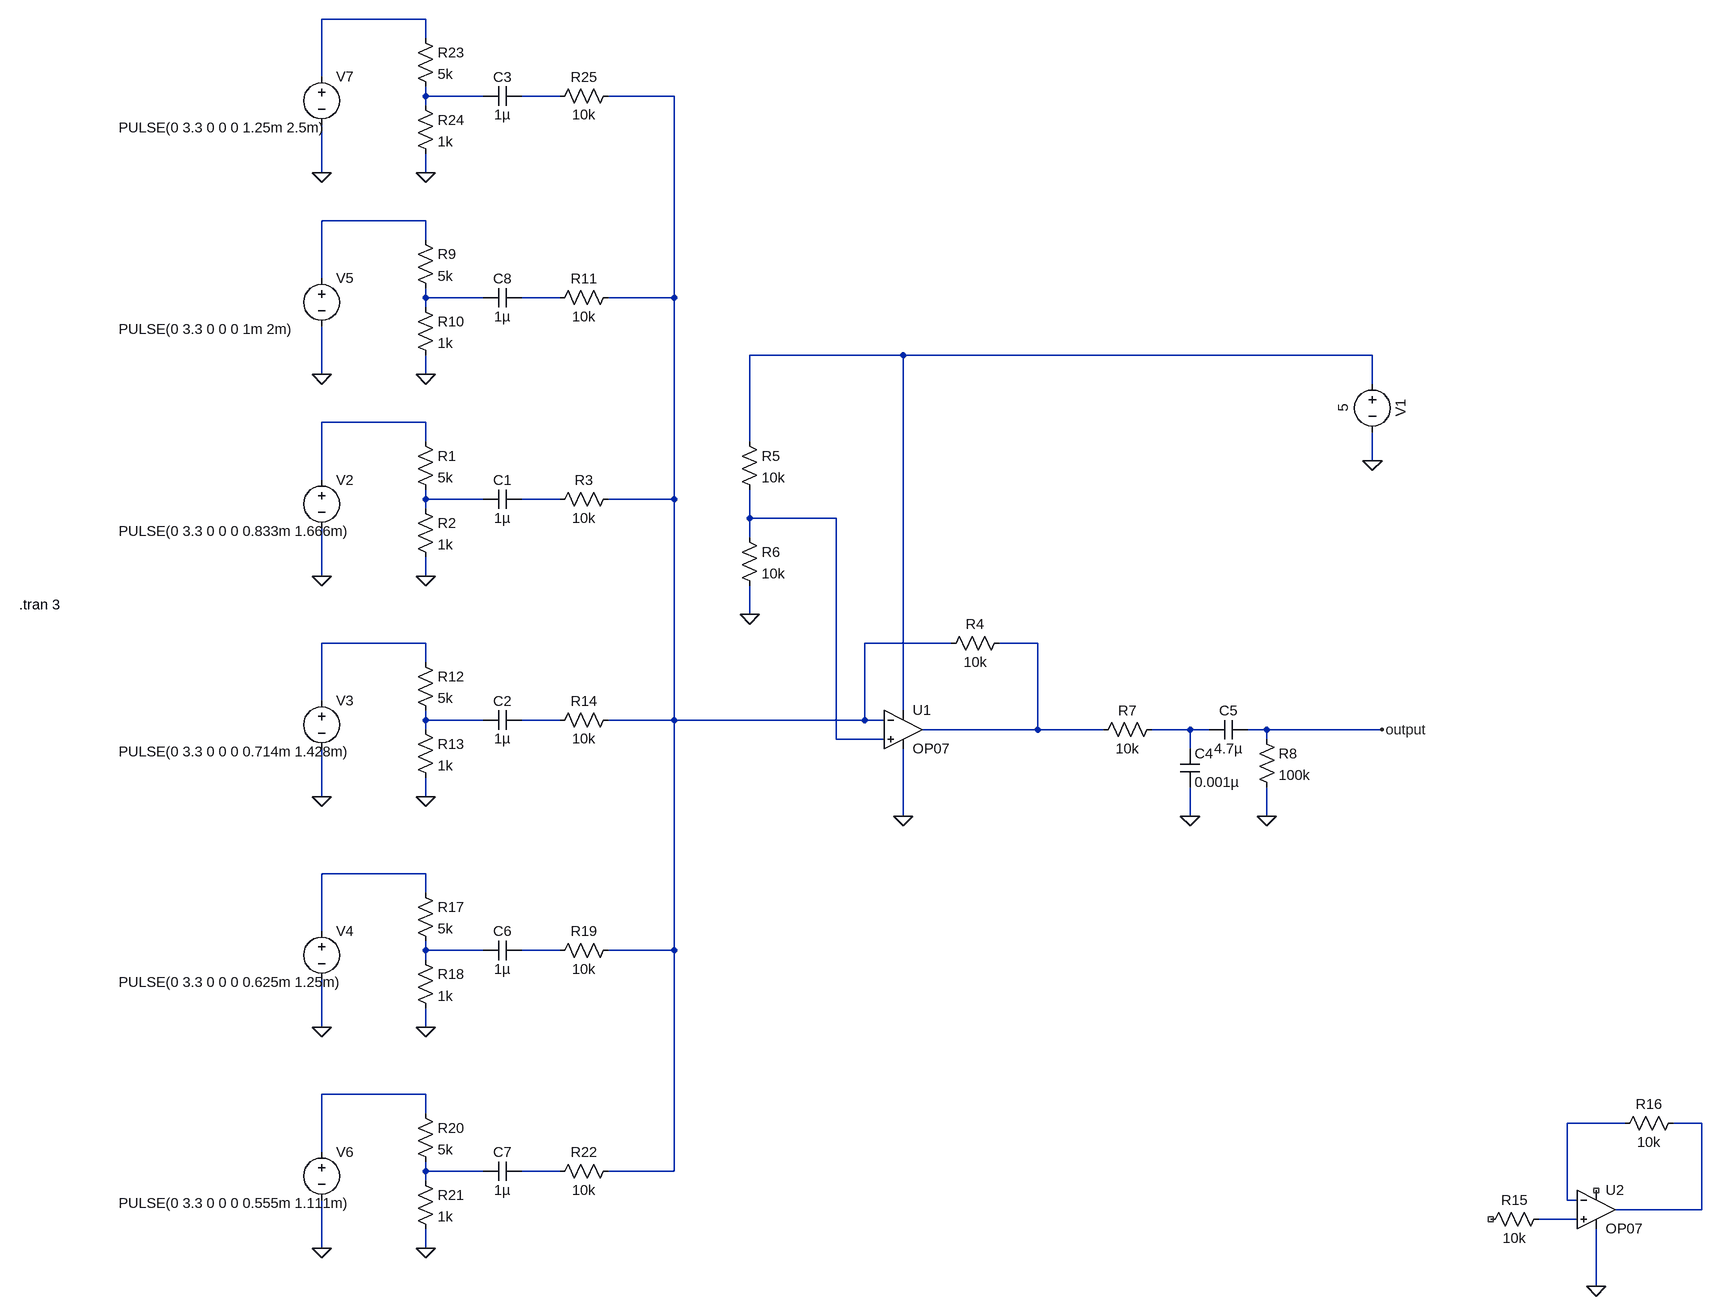
[diagram p0: schematic mixer_circuit_simulation.asc]
mixer_circuit_simulation.asc, the LTspice schematic file:
Version 4
SHEET 1 3092 1204
WIRE -592 -1200 -832 -1200
WIRE -592 -1168 -592 -1200
WIRE -832 -1104 -832 -1200
WIRE -592 -1072 -592 -1088
WIRE -496 -1072 -592 -1072
WIRE -368 -1072 -432 -1072
WIRE -128 -1072 -288 -1072
WIRE -592 -1056 -592 -1072
WIRE -832 -944 -832 -1024
WIRE -592 -944 -592 -976
WIRE -592 -864 -832 -864
WIRE -592 -832 -592 -864
WIRE -832 -768 -832 -864
WIRE -592 -736 -592 -752
WIRE -496 -736 -592 -736
WIRE -368 -736 -432 -736
WIRE -128 -736 -128 -1072
WIRE -128 -736 -288 -736
WIRE -592 -720 -592 -736
WIRE 384 -640 128 -640
WIRE 1216 -640 384 -640
WIRE -832 -608 -832 -688
WIRE -592 -608 -592 -640
WIRE 1216 -592 1216 -640
WIRE -592 -528 -832 -528
WIRE -592 -496 -592 -528
WIRE 128 -496 128 -640
WIRE 1216 -464 1216 -512
WIRE -832 -432 -832 -528
WIRE -592 -400 -592 -416
WIRE -496 -400 -592 -400
WIRE -368 -400 -432 -400
WIRE -128 -400 -128 -736
WIRE -128 -400 -288 -400
WIRE -592 -384 -592 -400
WIRE 128 -368 128 -416
WIRE 272 -368 128 -368
WIRE 128 -336 128 -368
WIRE -832 -272 -832 -352
WIRE -592 -272 -592 -304
WIRE 128 -208 128 -256
WIRE -592 -160 -832 -160
WIRE 464 -160 320 -160
WIRE 608 -160 544 -160
WIRE -592 -128 -592 -160
WIRE -832 -64 -832 -160
WIRE 384 -48 384 -640
WIRE -592 -32 -592 -48
WIRE -496 -32 -592 -32
WIRE -368 -32 -432 -32
WIRE -128 -32 -128 -400
WIRE -128 -32 -288 -32
WIRE 320 -32 320 -160
WIRE 320 -32 -128 -32
WIRE 352 -32 320 -32
WIRE -592 -16 -592 -32
WIRE 608 -16 608 -160
WIRE 608 -16 416 -16
WIRE 768 -16 608 -16
WIRE 912 -16 848 -16
WIRE 944 -16 912 -16
WIRE 1040 -16 1008 -16
WIRE 1232 -16 1040 -16
WIRE 272 0 272 -368
WIRE 352 0 272 0
WIRE 1040 0 1040 -16
WIRE 912 16 912 -16
WIRE -832 96 -832 16
WIRE -592 96 -592 64
WIRE 384 128 384 16
WIRE 912 128 912 80
WIRE 1040 128 1040 80
WIRE -592 224 -832 224
WIRE -592 256 -592 224
WIRE -832 320 -832 224
WIRE -592 352 -592 336
WIRE -496 352 -592 352
WIRE -368 352 -432 352
WIRE -128 352 -128 -32
WIRE -128 352 -288 352
WIRE -592 368 -592 352
WIRE -832 480 -832 400
WIRE -592 480 -592 448
WIRE -592 592 -832 592
WIRE -592 624 -592 592
WIRE 2272 640 2176 640
WIRE 2400 640 2352 640
WIRE -832 688 -832 592
WIRE -592 720 -592 704
WIRE -496 720 -592 720
WIRE -368 720 -432 720
WIRE -128 720 -128 352
WIRE -128 720 -288 720
WIRE -592 736 -592 720
WIRE 2176 768 2176 640
WIRE 2192 768 2176 768
WIRE 2400 784 2400 640
WIRE 2400 784 2256 784
WIRE 2192 800 2128 800
WIRE -832 848 -832 768
WIRE -592 848 -592 816
WIRE 2224 912 2224 816
FLAG 128 -208 0
FLAG 384 128 0
FLAG 1232 -16 output
FLAG 912 128 0
FLAG -832 -608 0
FLAG -592 -608 0
FLAG -832 -272 0
FLAG -592 -272 0
FLAG -832 96 0
FLAG -592 96 0
FLAG 2224 912 0
FLAG -832 480 0
FLAG -592 480 0
FLAG -832 848 0
FLAG -592 848 0
FLAG 1040 128 0
FLAG 1216 -464 0
FLAG -832 -944 0
FLAG -592 -944 0
SYMBOL res 560 -176 R90
WINDOW 0 0 56 VBottom 2
WINDOW 3 32 56 VTop 2
SYMATTR InstName R4
SYMATTR Value 10k
SYMBOL OpAmps\\OP07 384 -80 R0
SYMATTR InstName U1
SYMBOL voltage 1216 -608 R0
WINDOW 0 32 56 VTop 2
WINDOW 3 -32 56 VBottom 2
WINDOW 123 0 0 Left 0
WINDOW 39 0 0 Left 0
SYMATTR InstName V1
SYMATTR Value 5
SYMBOL res 112 -512 R0
SYMATTR InstName R5
SYMATTR Value 10k
SYMBOL res 112 -352 R0
SYMATTR InstName R6
SYMATTR Value 10k
SYMBOL res 864 -32 R90
WINDOW 0 0 56 VBottom 2
WINDOW 3 32 56 VTop 2
SYMATTR InstName R7
SYMATTR Value 10k
SYMBOL cap 896 16 R0
SYMATTR InstName C4
SYMATTR Value 0.001µ
SYMBOL res 1024 -16 R0
SYMATTR InstName R8
SYMATTR Value 100k
SYMBOL cap 1008 -32 R90
WINDOW 0 0 32 VBottom 2
WINDOW 3 32 32 VTop 2
SYMATTR InstName C5
SYMATTR Value 4.7µ
SYMBOL voltage -832 -784 R0
WINDOW 3 -338 101 Left 2
WINDOW 123 0 0 Left 0
WINDOW 39 0 0 Left 0
SYMATTR Value PULSE(0 3.3 0 0 0 1m 2m)
SYMATTR InstName V5
SYMBOL res -608 -848 R0
SYMATTR InstName R9
SYMATTR Value 5k
SYMBOL res -608 -736 R0
SYMATTR InstName R10
SYMATTR Value 1k
SYMBOL cap -432 -752 R90
WINDOW 0 0 32 VBottom 2
WINDOW 3 32 32 VTop 2
SYMATTR InstName C8
SYMATTR Value 1µ
SYMBOL res -272 -752 R90
WINDOW 0 0 56 VBottom 2
WINDOW 3 32 56 VTop 2
SYMATTR InstName R11
SYMATTR Value 10k
SYMBOL voltage -832 -448 R0
WINDOW 3 -338 101 Left 2
WINDOW 123 0 0 Left 0
WINDOW 39 0 0 Left 0
SYMATTR Value PULSE(0 3.3 0 0 0 0.833m 1.666m)
SYMATTR InstName V2
SYMBOL res -608 -512 R0
SYMATTR InstName R1
SYMATTR Value 5k
SYMBOL res -608 -400 R0
SYMATTR InstName R2
SYMATTR Value 1k
SYMBOL cap -432 -416 R90
WINDOW 0 0 32 VBottom 2
WINDOW 3 32 32 VTop 2
SYMATTR InstName C1
SYMATTR Value 1µ
SYMBOL res -272 -416 R90
WINDOW 0 0 56 VBottom 2
WINDOW 3 32 56 VTop 2
SYMATTR InstName R3
SYMATTR Value 10k
SYMBOL voltage -832 -80 R0
WINDOW 3 -338 101 Left 2
WINDOW 123 0 0 Left 0
WINDOW 39 0 0 Left 0
SYMATTR Value PULSE(0 3.3 0 0 0 0.714m 1.428m)
SYMATTR InstName V3
SYMBOL res -608 -144 R0
SYMATTR InstName R12
SYMATTR Value 5k
SYMBOL res -608 -32 R0
SYMATTR InstName R13
SYMATTR Value 1k
SYMBOL cap -432 -48 R90
WINDOW 0 0 32 VBottom 2
WINDOW 3 32 32 VTop 2
SYMATTR InstName C2
SYMATTR Value 1µ
SYMBOL res -272 -48 R90
WINDOW 0 0 56 VBottom 2
WINDOW 3 32 56 VTop 2
SYMATTR InstName R14
SYMATTR Value 10k
SYMBOL OpAmps\\OP07 2224 720 R0
SYMATTR InstName U2
SYMBOL res 2144 784 R90
WINDOW 0 0 56 VBottom 2
WINDOW 3 32 56 VTop 2
SYMATTR InstName R15
SYMATTR Value 10k
SYMBOL res 2368 624 R90
WINDOW 0 0 56 VBottom 2
WINDOW 3 32 56 VTop 2
SYMATTR InstName R16
SYMATTR Value 10k
SYMBOL voltage -832 304 R0
WINDOW 3 -338 101 Left 2
WINDOW 123 0 0 Left 0
WINDOW 39 0 0 Left 0
SYMATTR Value PULSE(0 3.3 0 0 0 0.625m 1.25m)
SYMATTR InstName V4
SYMBOL res -608 240 R0
SYMATTR InstName R17
SYMATTR Value 5k
SYMBOL res -608 352 R0
SYMATTR InstName R18
SYMATTR Value 1k
SYMBOL cap -432 336 R90
WINDOW 0 0 32 VBottom 2
WINDOW 3 32 32 VTop 2
SYMATTR InstName C6
SYMATTR Value 1µ
SYMBOL res -272 336 R90
WINDOW 0 0 56 VBottom 2
WINDOW 3 32 56 VTop 2
SYMATTR InstName R19
SYMATTR Value 10k
SYMBOL voltage -832 672 R0
WINDOW 3 -338 101 Left 2
WINDOW 123 0 0 Left 0
WINDOW 39 0 0 Left 0
SYMATTR Value PULSE(0 3.3 0 0 0 0.555m 1.111m)
SYMATTR InstName V6
SYMBOL res -608 608 R0
SYMATTR InstName R20
SYMATTR Value 5k
SYMBOL res -608 720 R0
SYMATTR InstName R21
SYMATTR Value 1k
SYMBOL cap -432 704 R90
WINDOW 0 0 32 VBottom 2
WINDOW 3 32 32 VTop 2
SYMATTR InstName C7
SYMATTR Value 1µ
SYMBOL res -272 704 R90
WINDOW 0 0 56 VBottom 2
WINDOW 3 32 56 VTop 2
SYMATTR InstName R22
SYMATTR Value 10k
SYMBOL voltage -832 -1120 R0
WINDOW 3 -338 101 Left 2
WINDOW 123 0 0 Left 0
WINDOW 39 0 0 Left 0
SYMATTR Value PULSE(0 3.3 0 0 0 1.25m 2.5m)
SYMATTR InstName V7
SYMBOL res -608 -1184 R0
SYMATTR InstName R23
SYMATTR Value 5k
SYMBOL res -608 -1072 R0
SYMATTR InstName R24
SYMATTR Value 1k
SYMBOL cap -432 -1088 R90
WINDOW 0 0 32 VBottom 2
WINDOW 3 32 32 VTop 2
SYMATTR InstName C3
SYMATTR Value 1µ
SYMBOL res -272 -1088 R90
WINDOW 0 0 56 VBottom 2
WINDOW 3 32 56 VTop 2
SYMATTR InstName R25
SYMATTR Value 10k
TEXT -1336 -224 Left 2 !.tran 3

The netlist it stands for:
* mixer_circuit_simulation.asc
R4 N014 N004 10k
XU1 N012 N004 N008 0 N014 LT1001  ; OP07, pins In+ In- V+ V- OUT
V1 N008 0 5
R5 N008 N012 10k
R6 N012 0 10k
R7 N017 N014 10k
C4 N017 0 0.001µ
R8 output 0 100k
C5 output N017 4.7µ
V5 N005 0 PULSE(0 3.3 0 0 0 1m 2m)
R9 N005 N006 5k
R10 N006 0 1k
C8 N007 N006 1µ
R11 N004 N007 10k
V2 N009 0 PULSE(0 3.3 0 0 0 0.833m 1.666m)
R1 N009 N010 5k
R2 N010 0 1k
C1 N011 N010 1µ
R3 N004 N011 10k
V3 N013 0 PULSE(0 3.3 0 0 0 0.714m 1.428m)
R12 N013 N015 5k
R13 N015 0 1k
C2 N016 N015 1µ
R14 N004 N016 10k
XU2 N026 N022 NC_01 0 N023 LT1001  ; OP07, pins In+ In- V+ V- OUT
R15 N026 NC_02 10k
R16 N023 N022 10k
V4 N018 0 PULSE(0 3.3 0 0 0 0.625m 1.25m)
R17 N018 N019 5k
R18 N019 0 1k
C6 N020 N019 1µ
R19 N004 N020 10k
V6 N021 0 PULSE(0 3.3 0 0 0 0.555m 1.111m)
R20 N021 N024 5k
R21 N024 0 1k
C7 N025 N024 1µ
R22 N004 N025 10k
V7 N001 0 PULSE(0 3.3 0 0 0 1.25m 2.5m)
R23 N001 N002 5k
R24 N002 0 1k
C3 N003 N002 1µ
R25 N004 N003 10k
.tran 3
.lib LTC.lib
.backanno
.end